# Altium project Region_SU.PrjPcb
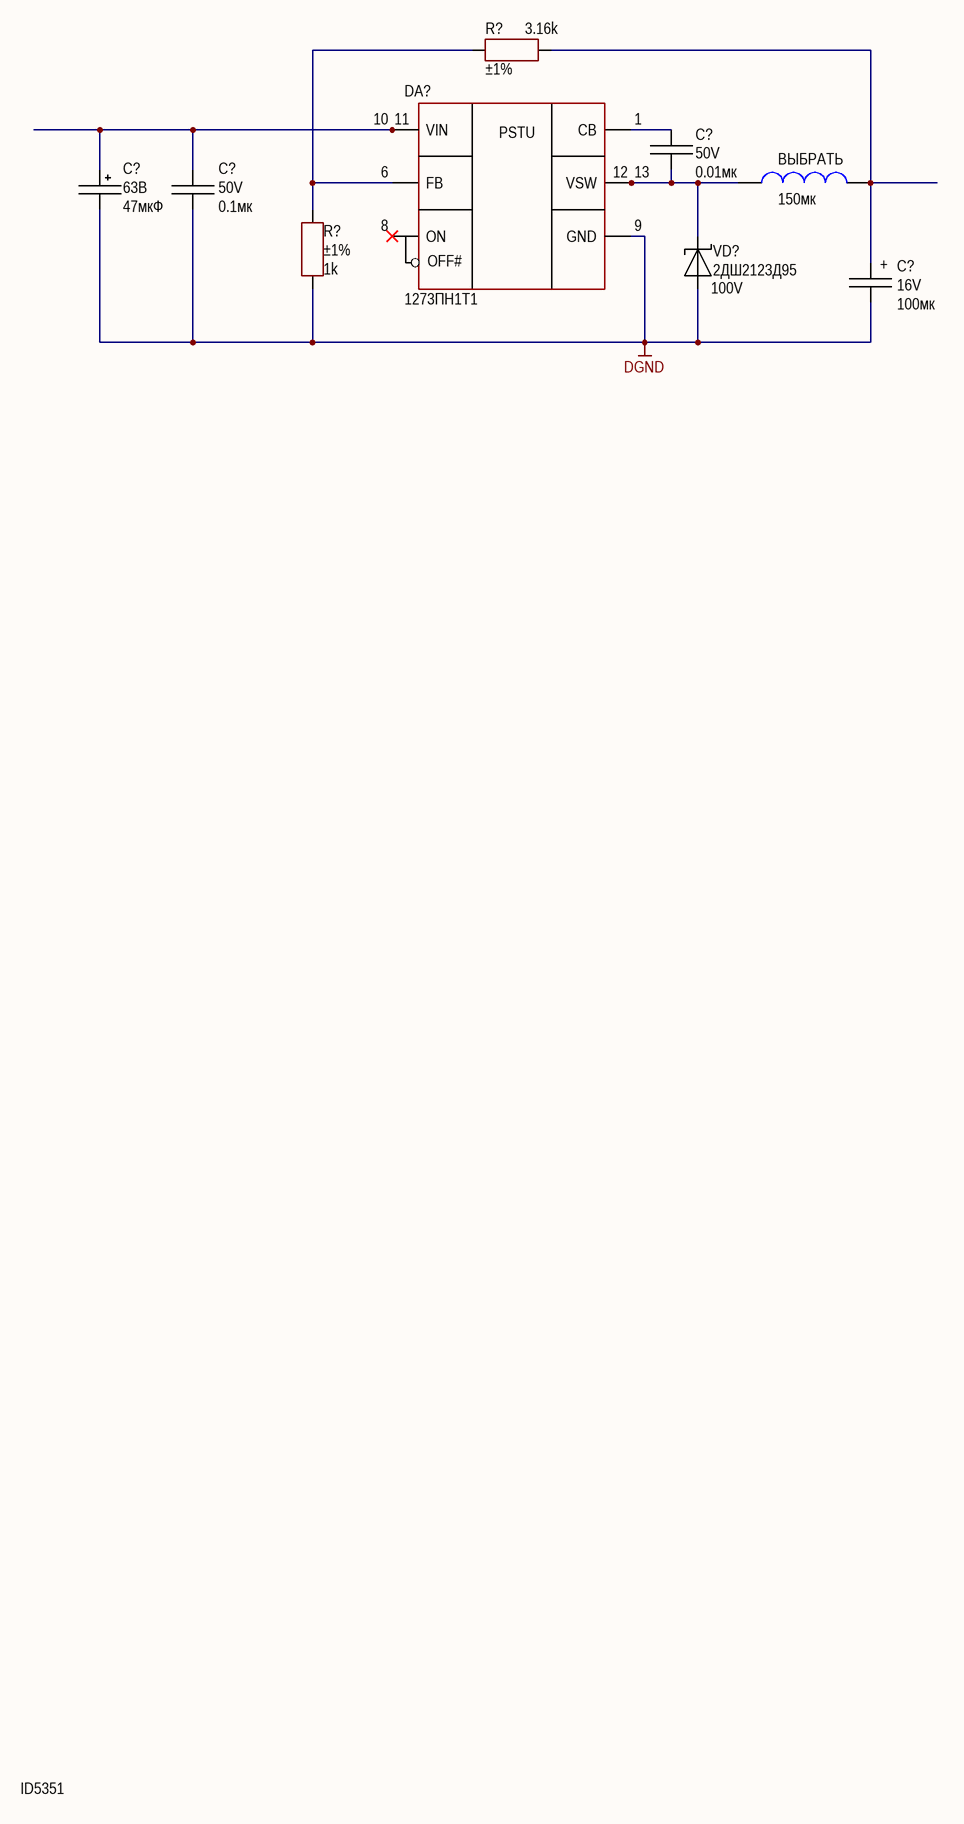
[diagram p0: Sheet1.SchDoc]
1 sheet, 9 parts. Net scope: global (net labels, ports and power ports of the same name join across sheets).

## Sheet Sheet1.SchDoc
size 594 x 420 mm; Language: en; ResponsibleDept: DED; DocumentStatus: Released; DecimalNumber: {DecimalNumber}; ApprovedBy: Мельников; CheckedBy: Лячин; CompanyName: Диаконт; DrawnBy: Тихонов; DocumentNumber: ЭИТЦЯ.436434.018; SheetTotal: 1; Title0: Модуль питания РМ; DocumentType: Схема электрическая принципиальная; Liter: Э; NormControl: Солтык; PageSetup: Record=PageOptions|CenterHorizontal=True|CenterVertical=True|PrintScale=0.96|XCorrection=1.00|YCorrection=1.00|PrintKind=1|BorderSize=5000000|LeftOffset=0|BottomOffset=0|Orientation=2|PaperLength=1000|PaperWidth=1000|Scale=100|PaperSource=7|PrintQuality=-4|MediaType=1|DitherType=10|PaperKind=A3|PrintScaleMode=1; FirstApp: ЭИТЦЯ.436434.018

### Parts
(Parts that share a designator on the sheet are numbered #1, #2 ... from top to bottom, then left to right.)
C?#1  value 0.01мк  Voltage: 50V  [CAP: 0603+0805]
C?#2  value 47мкФ  Voltage: 63В  [CAP: D10C5H12.5]
C?#3  value 0.1мк  Voltage: 50V  [CAP: 0805+1206]
C?#4  value 100мк  Polarity: +  Voltage: 16V  [CAP: TANTAL-E]
DA?  (no value)  [401.14-5М]
R?#1  value 3.16k  Tolerance: ±1%  [RES: 0603P]
R?#2  value 1k  Tolerance: ±1%  [RES: 0603P]
VD?  Voltage: 100V  PartNumber: 2ДШ2123Д95  [КТ-99-1]  (hidden comment: ВЗПП Сборка Воронеж)
ВЫБРАТЬ  value 150мк  [IND: R22.9/14/7.62 (H)]

### Nets
DGND: C?#2.2 C?#3.1 C?#4.1 DA?.9(GND) R?#2.2 VD?.A
NetC?#1_1: C?#1.1 DA?.12(VSW) DA?.13(VSW) VD?.C ВЫБРАТЬ.2
NetC?#1_2: C?#1.2 DA?.1(CB)
NetC?#2_1: C?#2.1 C?#3.2 DA?.10(VIN) DA?.11(VIN)
NetC?#4_2: C?#4.2 R?#1.2 ВЫБРАТЬ.1
NetDA?_6: DA?.6(FB) R?#1.1 R?#2.1

Not connected (* = marked no-connect by the designer): DA? 8(ON)*

### Notes on the sheet
- ID5351
- Перв. примен.
- Справ. №
- Подп. и дата
- Инв. № дубл.
- Взам. инв. №
- Изм.
- Лист
- № докум.
- Подп.
- Дата
- Лит.
- Масса
- Масштаб
- Разраб.
- Пров.
- Т. контр.
- Листов
- Инв. № подл.
- Н. контр.
- Утв.
- Копировал
- Формат A2
- (in symbol 1273ПН1T1) PSTU; OFF#

### Library data of the parts
C?#1 = Ceramic_0603: Manufacturer: Монолит; PartNumber: К10-84в-1608М-50В-0,01 мкФ ±10%-Н20-N-A; ValueManufacturerPartNumber: Ceramic capacitor, 0.01мк, Н20, ±10%, 50V, 0603,; TypeCapacitor: Ceramic capacitor; Tolerance: ±10%; TypeDielectric: Н20; Analog: MAX 00123301 (K10-17в - 0805); Package: 0603; HelpURL: http://www.monolit.vitebsk.by/Files/K10-84.pdf
C?#2 = Aluminium: Manufacturer: Элеконд; PartNumber: К50-68-63В - 47мкФ ±20% В; ValueManufacturerPartNumber: Aluminium capacitor, 47мкФ, 63В, ±20%, 1 Ом, 10x12 mm,; TypeCapacitor: Aluminium capacitor; Tolerance: ±20%; Impedance: 1 Ом; MAX: 00149833; Package: 10x12 mm; HelpURL: https://elecond.ru/production/capacitors/aluminum/k50-68
C?#3 = Ceramic_1210: Manufacturer: Монолит; PartNumber: К10-84в-2012М-50В-0,1 мкФ +80/-20%-Н90-N-A; ValueManufacturerPartNumber: Ceramic capacitor, 0.1мк, Н20, ±10%, 50V, 0805,; TypeCapacitor: Ceramic capacitor; Tolerance: ±10%; TypeDielectric: Н20; Analog: MAX 00123747 (К10-17в - с1206); Package: 0805; HelpURL: http://www.monolit.vitebsk.by/Files/K10-84.pdf
C?#4 = Tantal_E: Manufacturer: Элеконд; PartNumber: К53-68 "E"-16 В-100 мкф ±10%; ValueManufacturerPartNumber: Tantalum capacitor, 100мк, 16V, ±10%, 0.5-0.7 Ом, case E, -60...+125°C; Impedance: 0.5-0.7 Ом; Tolerance: ±10%; TypeCapacitor: Tantalum capacitor; MAX: 00145468; Package: case E; HelpURL: https://eandc.ru/pdf/kondensator/k53-68.pdf; Temperature: -60...+125°C
DA? = 1273ПН1T1: USSR Buck converter; Manufacturer: НИИЭТ; ValueManufacturerPartNumber: DC/DC buck converter, input 8...40V, 260 кHz, output 1.21...37V, 1A, -60...+115°C, 401.14-5М; VoltageInput: input 8...40V; Frequency: 260 кHz; CurrentOutput: 1A; VoltageOutput: output 1.21...37V; Analog: LM2675-ADJ; HelpURL: https://niiet.ru/product/id33; Package: 401.14-5М; ComponentType: DC/DC buck converter; Temperature: -60...+115°C; PartNumber: 1273ПН1T1
R?#1 = Resistor_0603: Manufacturer: ОАО Ресурс; PartNumber: Р1-12-0,1ум.-3.16~кОм ±1%-М ШКАБ.434110.002 ТУ; ValueManufacturerPartNumber: Resistor film, 3.16k, ±1%, 0603, 0.1W, -55...+125°C; TypeResistor: Resistor film; Power: 0.1W; MAX: 00134037; Package: 0603; HelpURL: https://aoresurs.com/catalog/chip_rezistory/rezistory-r1-12-kategoriya-kachestva-vp-/; Temperature: -55...+125°C
R?#2 = Resistor_0603: Manufacturer: ОАО Ресурс; PartNumber: Р1-12-0,1ум.-1~кОм ±1%-М ШКАБ.434110.002 ТУ; ValueManufacturerPartNumber: Resistor film, 1k, ±1%, 0603, 0.1W, -55...+125°C; TypeResistor: Resistor film; Power: 0.1W; MAX: 00133971; Package: 0603; HelpURL: https://aoresurs.com/catalog/chip_rezistory/rezistory-r1-12-kategoriya-kachestva-vp-/; Temperature: -55...+125°C
VD? = Schottky_single: TypeDiode: Schottky diode; Current: 1А; VoltageDrop: 0.78; Analog: 00136260 только для макета (pin-to-pin); Manufacturer: ВЗПП Сборка Воронеж; Package: КТ-99-1; ValueManufacturerPartNumber: ВЗПП Сборка Воронеж
ВЫБРАТЬ = Inductor_R22.9/14/7.62: Manufacturer: Magnetics; PartNumber: 0077310A7; ValueManufacturerPartNumber: Fixed inductor, 150мк, ±20%, R22.9/14/7.62, Kool Mu, µ=125, 90 нГн/витков2; TypeInductor: Fixed inductor; TypeMatiriel: Kool Mu; AL: 90 нГн/витков2; MaterialPermeability: µ=125; Tolerance: ±20%; Package: R22.9/14/7.62; HelpURL: http://ferrite.ru/warehouse/r-22-9147-62-77310-a7.html